# EAGLE design Hyper_VAPE (EAGLE 7.2.0)
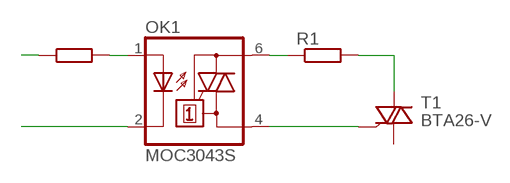
[diagram p0: schematic, sheet 1]

## Parts
OK1  MOC3043S  [DIL6-SMD]
R1  R-EU_0411/3V  [0411V]
R3  R0805  [R0805]
T1  BTA26-V  [TOP3S-1]

## Nets
N$1: OK1.4(A1) T1.G
N$2: OK1.6(A2) R1.1
N$3: R1.2 T1.A2
N$5: OK1.1(A) R3.2
N$6: OK1.2(C)
N$7: R3.1
Unconnected: T1.A1

## Library data of the parts
OK1 = optocoupler:MOC30*: 6-Pin DIP Zero-Cross Optoisolators Triac Driver Output (250/400 Volt Peak) Source: Data sheet <http://www.fairchildsemi.com/ds/MO/MOC3031M.pdf> The old path of data sheet not more available 2013-05-06.; MF: FAIRCHILD SEMICONDUCTOR; MPN: MOC3043SM; OC_FARNELL: 1505441; OC_NEWARK: 78K6091
R1 = rcl:R-EU_: RESISTOR, European symbol
R3 = CasaLibrary:R
T1 = triac:BTA26: 25A TRIAC Source: http://www.st.com/stonline/products/literature/ds/7470.pdf

## Board
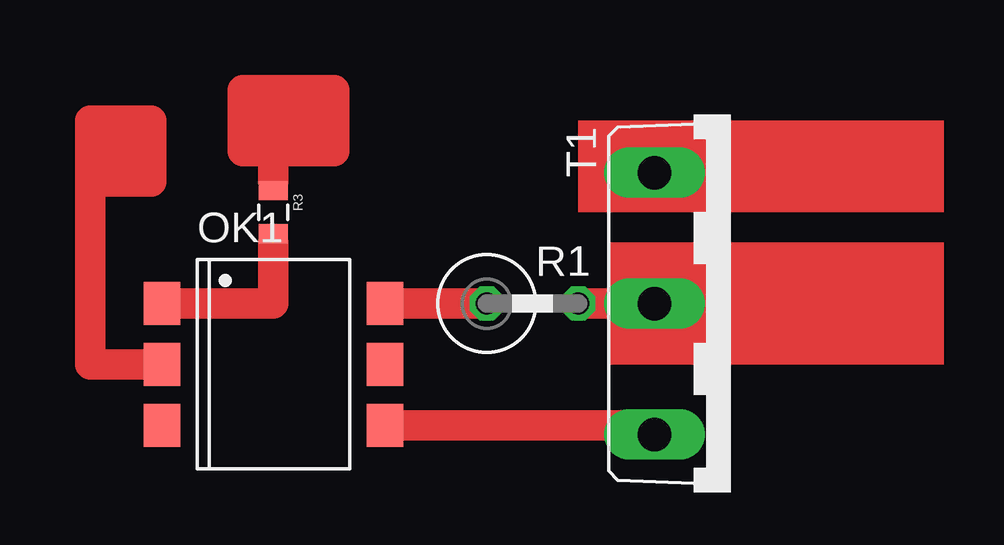
[diagram p1: board, top side]

No outline drawn. Coordinates in mm, seen from the top.
Copper layers (1*16): Top 0.035mm / dielectric 1.5mm / Bottom 0.035mm
Design rules "default": minimum track width 0.2mm, minimum drill 0.2mm, track to track 0.2mm, track to pad 0.2mm, pad to pad 0.2mm, via to via 0.2mm, smd to smd 0.2mm, copper to edge 0.2mm, drill to drill 0.2mm, minimum pad ring 10mil, minimum via ring 8mil, stop-mask expansion 4mil, vias tented up to drill 0mil, thermal gap 10mil

### Footprints (pad centres in the part's own frame; a part is rotated, then mirrored left to right if it is on the bottom)
DIL6-SMD = smd 1.78 x 1.52: 1 -2.54,-4.645; 2 0,-4.645; 3 2.54,-4.645; 4 2.54,4.645; 5 0,4.645; 6 -2.54,4.645
0411V = drill 0.914 octagon: 1 -2.54,0; 2 1.27,0
R0805 = smd 0.8 x 1.2: 1 -0.9,0; 2 0.9,0
TOP3S-1 = drill 1.397 long: A1 -5.461,-3.175; A2 0,-3.175; G 5.461,-3.175

### Placement (x,y rotation side)
OK1  7.62,17.78 270 top
R1  19.05,20.32 0 top
R3  7.62,24.13 270 top
T1  26.67,20.32 270 top

### Tracks (layer width: path | path; a pad name or v marks a point on that pad's centre or on a via)
N$1
  Top 1.27: OK1.4 24.13,15.24 T1.G
N$2
  Top 1.27: OK1.6 R1.1
N$3
  Top 1.27: R1.2 T1.A2
N$4
  Top 1.27: 2.54,17.78 0,17.78 0,25.4 | 0,25.4 2.54,25.4 2.54,26.67 | 2.54,26.67 0,26.67 | 0,26.67 0,25.4 | 0,26.67 0,27.94 2.54,27.94 2.54,26.67
N$5  (1 unrouted)
  Top 1.27: OK1.1 7.62,20.32 7.62,22.86
N$8
  Top 1.27: 7.62,25.4 7.62,27.94 | 6.35,27.94 6.35,29.21 10.16,29.21 10.16,27.94 | 10.16,27.94 7.62,27.94 | 7.62,27.94 6.35,27.94 | 6.35,27.94 6.35,26.67 10.16,26.67 10.16,27.94
(copper drawn outside any net)
  shapes: Top area x4